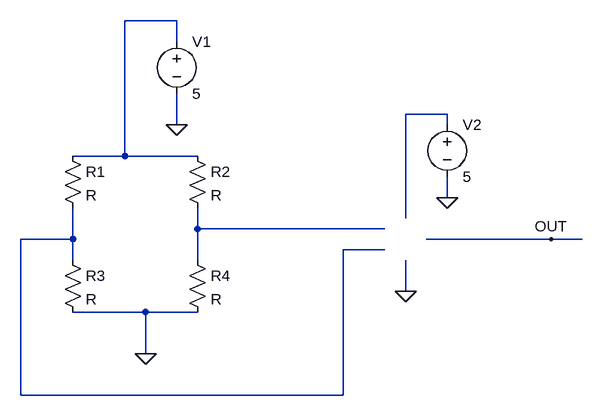
[diagram p0: schematic Draft1_StrainGauge.asc]
Draft1_StrainGauge.asc, the LTspice schematic file:
Version 4
SHEET 1 1032 680
WIRE 272 -112 192 -112
WIRE 272 -80 272 -112
WIRE 688 32 624 32
WIRE 272 48 272 0
WIRE 688 48 688 32
WIRE 192 96 192 -112
WIRE 192 96 112 96
WIRE 304 96 192 96
WIRE 688 160 688 128
WIRE 624 192 624 32
WIRE 304 208 304 176
WIRE 592 208 304 208
WIRE 112 224 112 176
WIRE 112 224 32 224
WIRE 848 224 656 224
WIRE 896 224 848 224
WIRE 592 240 528 240
WIRE 112 256 112 224
WIRE 304 256 304 208
WIRE 624 304 624 256
WIRE 224 336 112 336
WIRE 304 336 224 336
WIRE 224 400 224 336
WIRE 32 464 32 224
WIRE 528 464 528 240
WIRE 528 464 32 464
FLAG 272 48 0
FLAG 224 400 0
FLAG 688 160 0
FLAG 848 224 OUT
FLAG 624 304 0
SYMBOL res 96 80 R0
SYMATTR InstName R1
SYMBOL res 288 80 R0
SYMATTR InstName R2
SYMBOL res 96 240 R0
SYMATTR InstName R3
SYMBOL res 288 240 R0
SYMATTR InstName R4
SYMBOL voltage 272 -96 R0
WINDOW 123 0 0 Left 0
WINDOW 39 0 0 Left 0
SYMATTR InstName V1
SYMATTR Value 5
SYMBOL voltage 688 32 R0
WINDOW 123 0 0 Left 0
WINDOW 39 0 0 Left 0
SYMATTR InstName V2
SYMATTR Value 5

The netlist it stands for:
* Draft1_StrainGauge.asc
R1 N001 N004 R
R2 N001 N003 R
R3 N004 0 R
R4 N003 0 R
V1 N001 0 5
V2 N002 0 5
.backanno
.end